# EasyEDA Pro project ProProject_校电赛c题第二版_2024-10-13.epro, board PCB2
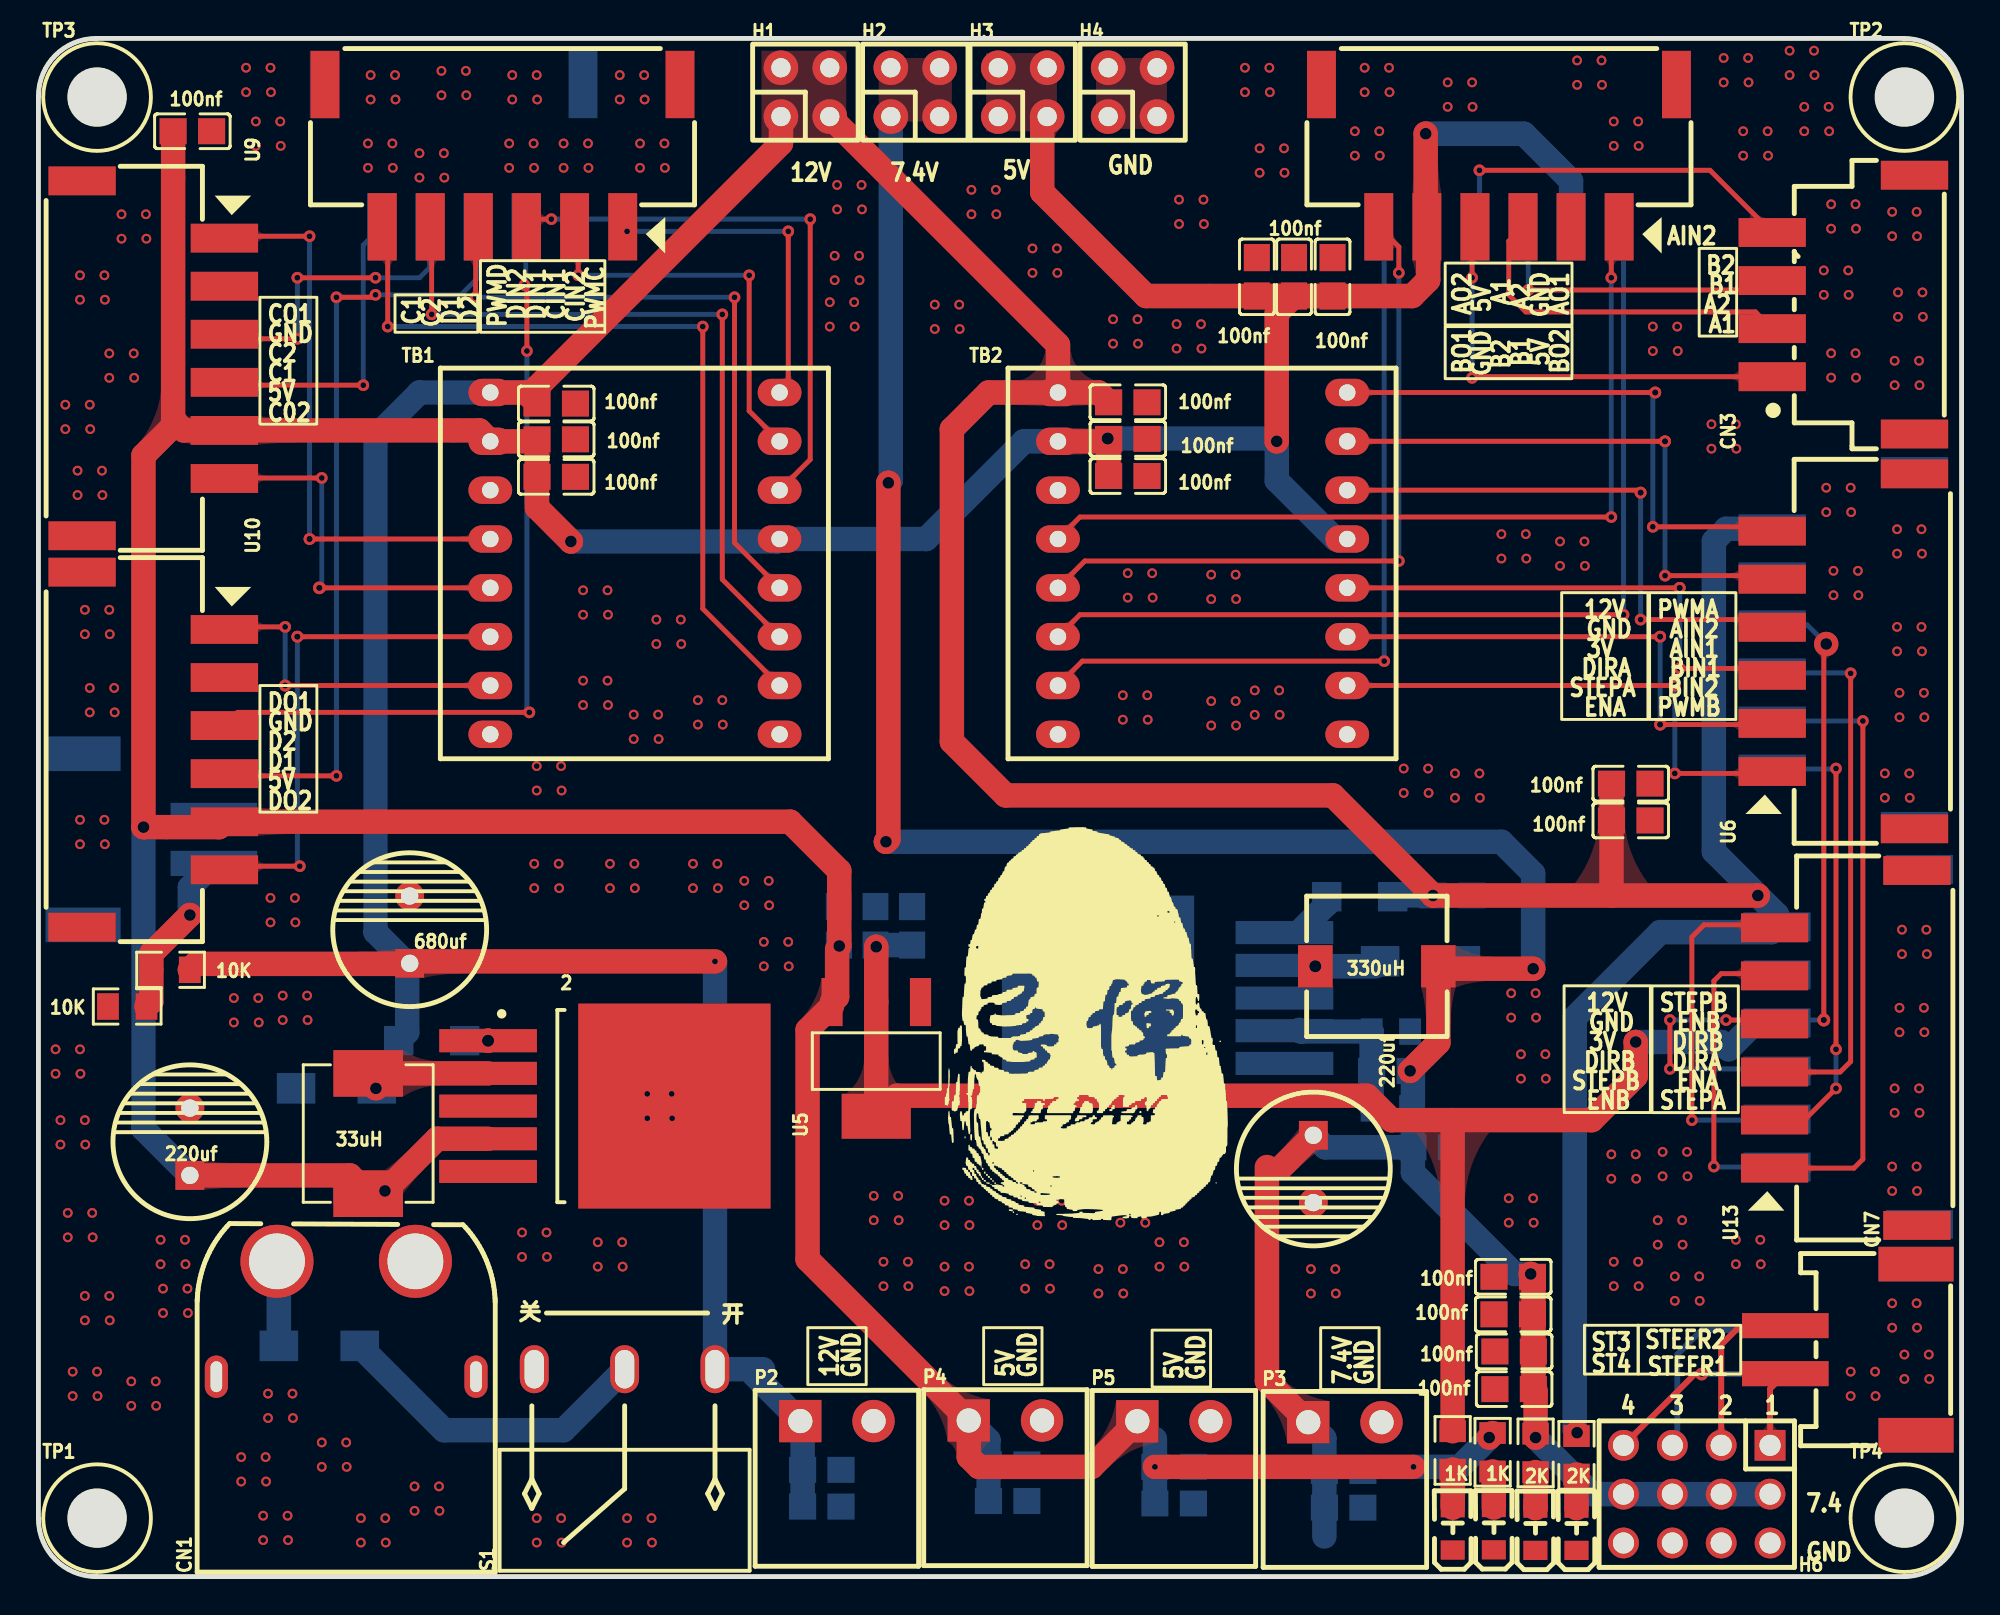
[diagram p4: board, top side]
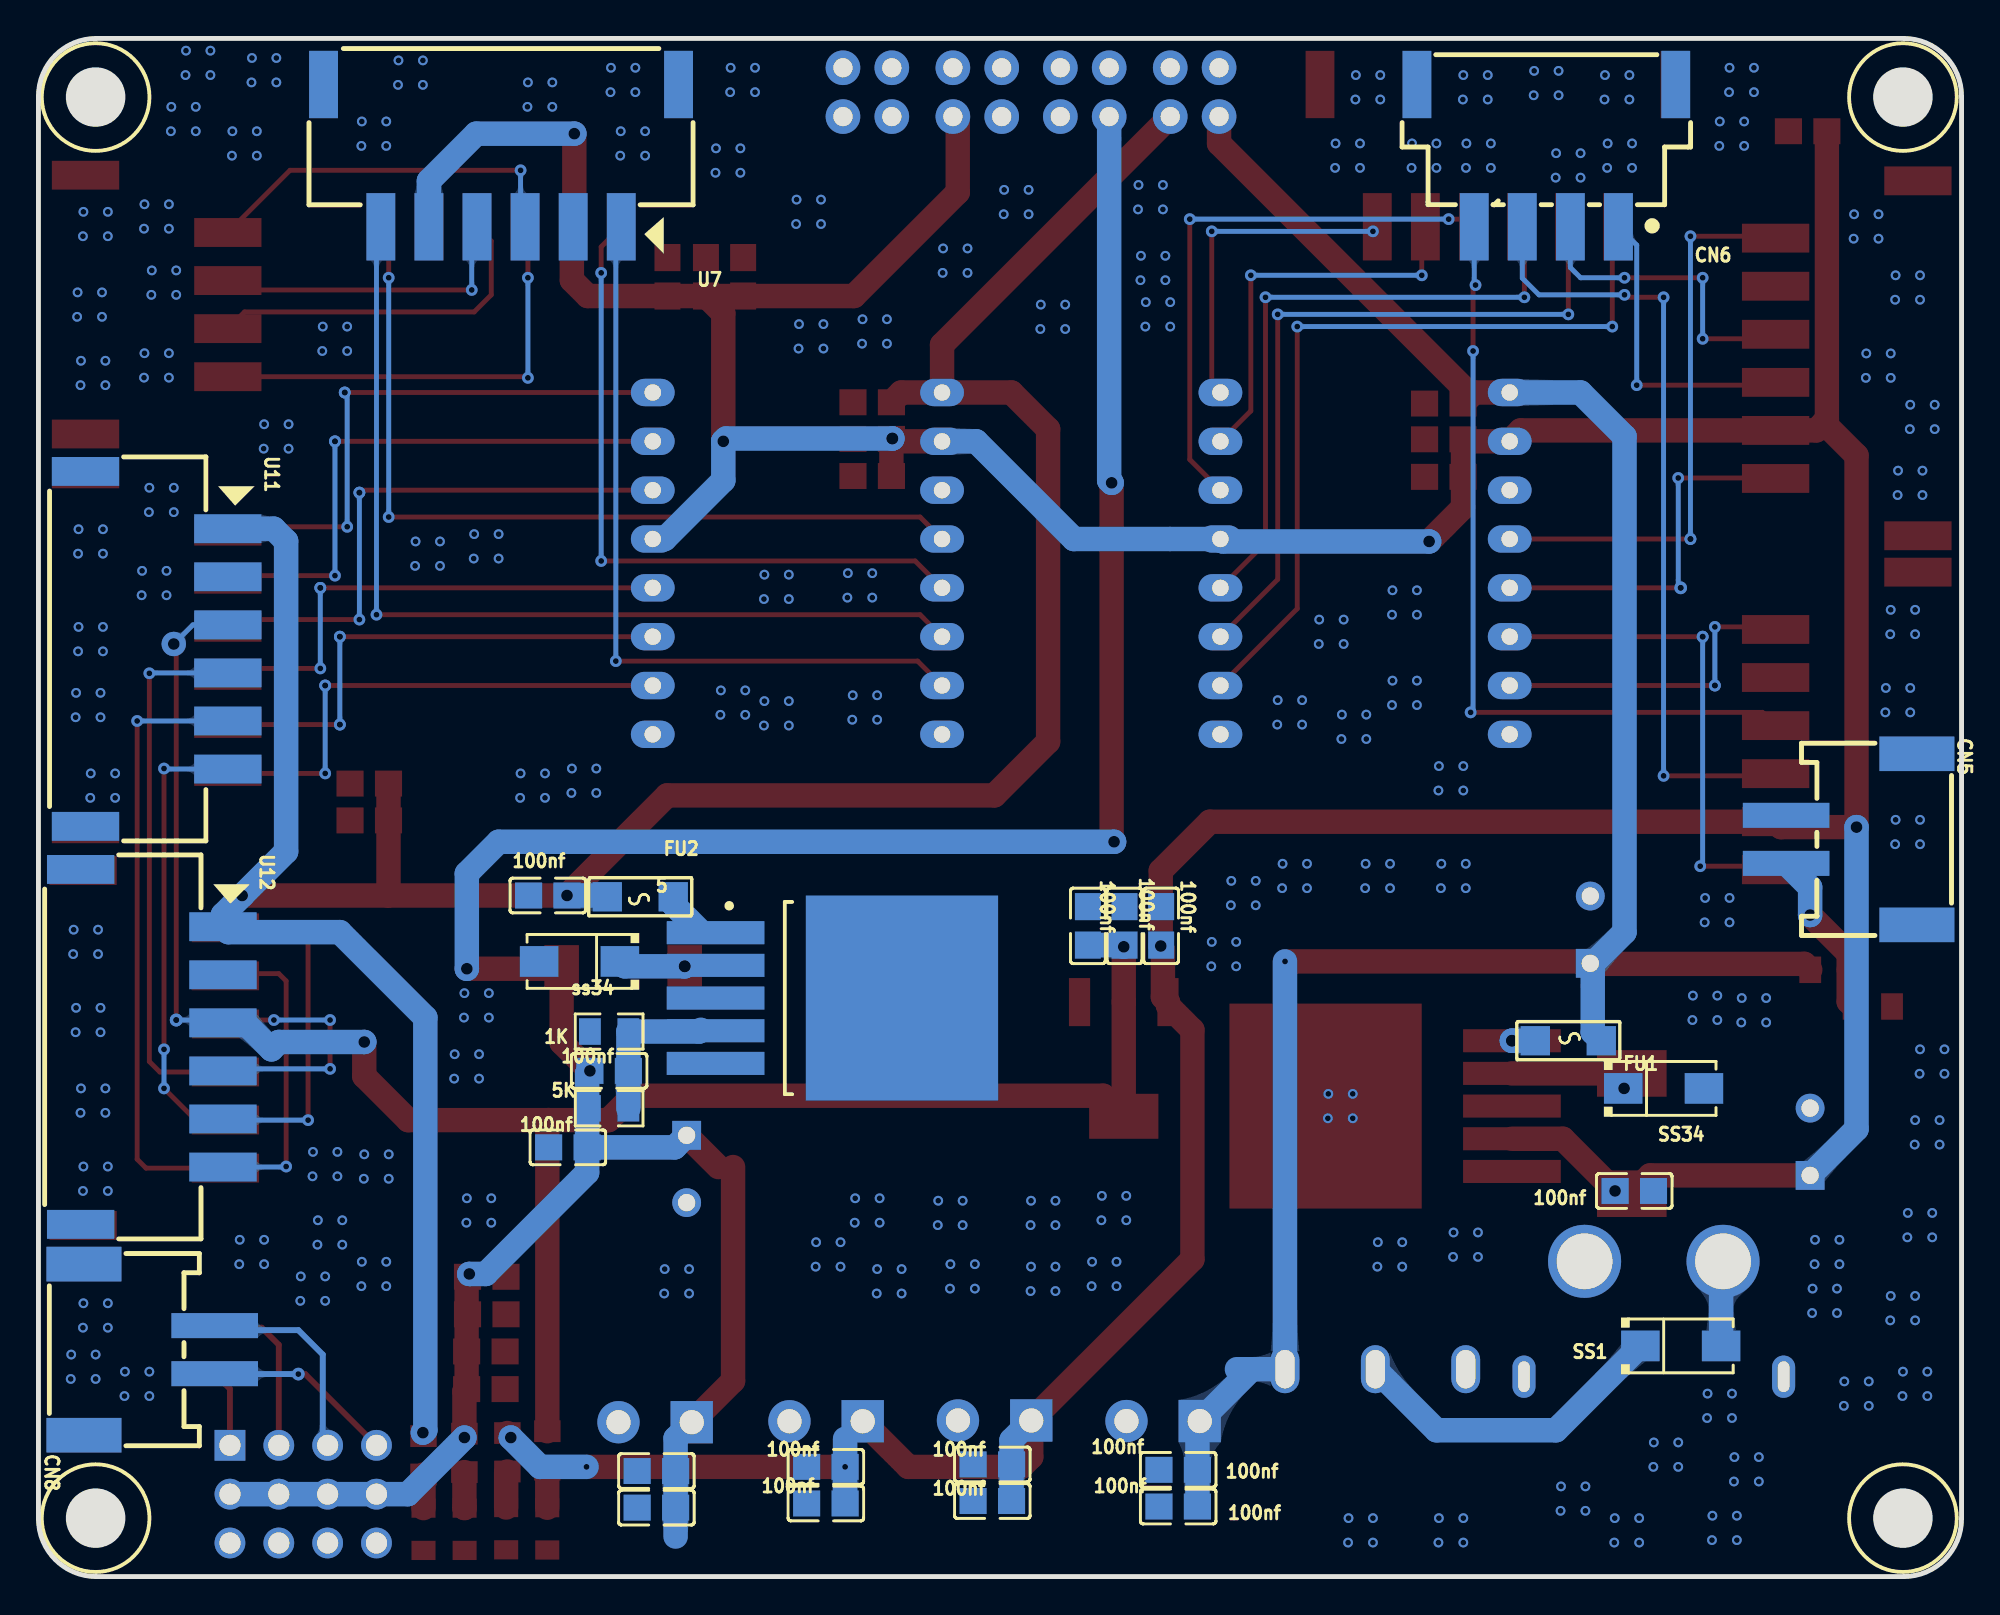
[diagram p5: board, bottom side, seen from below]

Outline 100 x 80 mm; copper layers: Top Layer, Bottom Layer. Coordinates in mm from the lower left corner of the outline.
Outline path: 0,77 0,3 arc(0.88,0.88) 3,0 97,0 arc(99.12,0.88) 100,3 100,77 arc(99.12,79.12) 97,80 3,80 arc(0.88,79.12) 0,77
Stack: Top Layer 0.035mm / Dielectric1 1.51mm FR4 er 4.5 / Bottom Layer 0.035mm

## Design rules (mm)
template: JLCPCB Capability(Two Layers Board)
spacing copperThickness1oz (default): track to track 0.102, other pairs 0.152 to 0.3
spacing copperThickness2oz: track to track 0.203, other pairs 0.152 to 0.3
track width copperThickness1oz (default): min 0.127, default 0.254, max 2.54
track width copperThickness2oz: min 0.203, default 0.254, max 2.54
differential pair differentialPair (default): width min 0.127, default 0.254, max 2.54; gap min 0.152, default 0.152
via viaSize (default): diameter min 0.5, default 0.61, max 10; hole min 0.3, default 0.305, max 6.3

## Placement (name value [footprint] x y rotation side)
1K  -  [R0805]  73.54 6.56 270 top
1K#2  -  [R0805]  75.62 6.46 270 top
1K#3  -  [R0805]  70.32 28.35 180 bottom
2  LM2596-5V  [lm2596]  26.45 25.11 0 top
2K  -  [R0805]  77.85 6.43 270 top
2K#2  -  [R0805]  79.98 6.31 270 top
5  LM2596-ADJ  [lm2596-adj]  60.45 29.96 180 bottom
5K  5K  [R0805]  70.32 24.36 0 bottom
10K  -  [R0805]  6.87 31.56 0 top
10K#2  -  [R0805]  4.61 29.65 0 top
33uH  33uH  [IND-SMD_L7.0-W6.6_FXL0630]  17.14 23.04 90 top
100nf  -  [C0805]  8 75.17 180 top
100nf#2  -  [C0805]  67.29 67.6 270 top
100nf#3  -  [C0805]  65.29 67.6 270 top
100nf#4  -  [C0805]  56.65 61.08 0 top
100nf#5  -  [C0805]  56.65 59.17 0 top
100nf#6  -  [C0805]  56.65 57.24 0 top
100nf#7  -  [C0805]  26.92 61.01 0 top
100nf#8  -  [C0805]  26.92 59.15 0 top
100nf#9  -  [C0805]  26.92 57.2 0 top
100nf#10  -  [C0805]  63.36 67.6 270 top
100nf#11  -  [C0805]  82.8 39.33 0 top
100nf#12  -  [C0805]  82.8 41.24 0 top
100nf#13  -  [C0805]  76.74 9.75 0 top
100nf#14  -  [C0805]  76.74 11.71 0 top
100nf#15  -  [C0805]  76.69 13.64 0 top
100nf#16  -  [C0805]  76.69 15.59 0 top
100nf#17  -  [C0805]  17.02 20.06 0 bottom
100nf#18  -  [C0805]  73.52 35.42 180 bottom
100nf#19  -  [C0805]  70.32 26.3 0 bottom
100nf#20  -  [C0805]  72.47 22.32 180 bottom
100nf#21  -  [C0805]  40.73 5.55 0 bottom
100nf#22  -  [C0805]  40.73 3.64 0 bottom
100nf#23  -  [C0805]  67.87 5.49 0 bottom
100nf#24  -  [C0805]  67.87 3.58 0 bottom
100nf#25  -  [C0805]  50.4 5.83 0 bottom
100nf#26  -  [C0805]  50.4 3.93 0 bottom
100nf#27  -  [C0805]  59.05 5.71 0 bottom
100nf#28  -  [C0805]  59.05 3.8 0 bottom
100nf#29  -  [C0805]  41.62 33.84 90 bottom
100nf#30  -  [C0805]  43.53 33.84 90 bottom
100nf#31  -  [C0805]  45.43 33.84 90 bottom
220uf  -  [680uf]  7.87 22.61 90 top
220uf#2  -  [680uf]  66.29 21.2 270 top
330uH  330uH  [IND-SMD_L7.3-W7.3_YPRH0704]  69.6 31.74 0 top
680uf  -  [680uf]  19.3 33.65 90 top
CN1  XT60PW-M  [CONN-TH_XT60PW-M]  16 13.4 90 top
CN3  WAFER-254W-4A  [CONN-SMD_4P-P2.50-WAFER-254W-4P]  93.85 66.16 90 top
CN5  HCZZ0021-2  [CONN-SMD_2P-P2.50-A2501-WF-02A]  5.72 38.34 270 bottom
CN6  WAFER-254W-4A  [CONN-SMD_4P-P2.50-WAFER-254W-4P]  21.59 73.9 0 bottom
CN7  HCZZ0021-2  [CONN-SMD_2P-P2.50-A2501-WF-02A]  94.23 11.8 270 top
CN8  HCZZ0021-2  [CONN-SMD_2P-P2.50-A2501-WF-02A]  94.23 11.8 90 bottom
FU1  3A  [3a熔断器]  20.45 27.68 0 bottom
FU2  3A  [3a熔断器]  68.71 35.55 180 bottom
H1  -  [HDR-TH_4P-P2.54-V-F-R2-C2-S2.54]  39.88 77.21 0 top
H2  -  [HDR-TH_4P-P2.54-V-F-R2-C2-S2.54]  45.59 77.21 0 top
H3  -  [HDR-TH_4P-P2.54-V-F-R2-C2-S2.54]  51.18 77.21 0 top
H4  -  [HDR-TH_4P-P2.54-V-F-R2-C2-S2.54]  56.9 77.21 0 top
H6  01.5.5.1.304.03  [HDR-TH_12P-P2.54-V-M-R3-C4-S2.54]  86.23 4.29 180 top
LED1  -  [LED_0805]  79.98 2.51 90 top
LED2  -  [LED_0805]  77.85 2.51 90 top
LED3  -  [LED_0805]  75.68 2.54 90 top
LED4  -  [LED_0805]  73.55 2.53 90 top
P2  WJ15EDGRC-3.81-2P  [CONN-TH_2P-P3.81_WJ15EDGRC-3.81-2P]  41.52 8.09 0 top
P3  WJ15EDGRC-3.81-2P  [CONN-TH_2P-P3.81_WJ15EDGRC-3.81-2P]  67.93 8.03 0 top
P4  WJ15EDGRC-3.81-2P  [CONN-TH_2P-P3.81_WJ15EDGRC-3.81-2P]  50.28 8.12 0 top
P5  WJ15EDGRC-3.81-2P  [CONN-TH_2P-P3.81_WJ15EDGRC-3.81-2P]  59.04 8.08 0 top
S1  单刀双掷  [弯]  30.48 3.29 90 top
SS1  SS34  [SMA_L4.3-W2.5-LS5.0-RD]  14.6 12 180 bottom
ss34  SS34  [SMA_L4.3-W2.5-LS5.0-RD]  71.87 31.99 0 bottom
SS34  SS34  [SMA_L4.3-W2.5-LS5.0-RD]  15.49 25.39 180 bottom
TB1  TB6612-MOD  [tb6612fng封装]  30.99 52.7 0 top
TB2  TB6612-MOD  [tb6612fng封装]  60.51 52.7 0 top
TP1  M3铜柱带丝印  [M3铜柱]  3.05 3.04 0 top
TP2  M3铜柱带丝印  [M3铜柱]  97.03 76.95 0 top
TP3  M3铜柱带丝印  [M3铜柱]  3.05 76.95 0 top
TP4  M3铜柱带丝印  [M3铜柱]  97.03 3.04 0 top
U4  BX-XH2.54-6PWT  [CONN-SMD_6P-P2.50_BX-XH2.54-6PWT]  75.95 73.9 180 top
U5  AMS1117-3.3  [SOT-223-3_L6.5-W3.4-P2.30-LS7.0-BR]  43.57 26.91 90 top
U6  BX-XH2.54-6PWT  [CONN-SMD_6P-P2.50_BX-XH2.54-6PWT]  93.85 48.12 90 top
U7  BX-XH2.54-6PWT  [CONN-SMD_6P-P2.50_BX-XH2.54-6PWT]  75.95 73.9 0 bottom
U8  BX-XH2.54-6PWT  [CONN-SMD_6P-P2.50_BX-XH2.54-6PWT]  24.13 73.9 180 top
U9  BX-XH2.54-6PWT  [CONN-SMD_6P-P2.50_BX-XH2.54-6PWT]  5.97 63.36 270 top
U10  BX-XH2.54-6PWT  [CONN-SMD_6P-P2.50_BX-XH2.54-6PWT]  5.97 43.01 270 top
U11  BX-XH2.54-6PWT  [CONN-SMD_6P-P2.50_BX-XH2.54-6PWT]  93.85 48.25 270 bottom
U12  BX-XH2.54-6PWT  [CONN-SMD_6P-P2.50_BX-XH2.54-6PWT]  94.11 27.55 270 bottom
U13  BX-XH2.54-6PWT  [CONN-SMD_6P-P2.50_BX-XH2.54-6PWT]  93.98 27.49 90 top

## Footprints (pads in the part's own frame, mm; a bottom-side part is the same pattern mirrored in y, then rotated)
3a熔断器
  rect 1.524x1.524 smd: 1(-1.714,-0.194) 2(1.714,-0.194)
680uf
  rect 1.5x1.5 hole 0.9: 1(-1.75,0)
  round 1.5 hole 0.9: 2(1.75,0)
C0805
  rect 1.41x1.35 smd: 1(-1,0) 2(1,0)
CONN-SMD_2P-P2.50-A2501-WF-02A
  rect 1.3x4.5 smd: 1(-1.25,-3.4) 2(1.25,-3.4)
  rect 1.8x3.9 smd: 3(-4.45,3.4) 4(4.45,3.4)
CONN-SMD_4P-P2.50-WAFER-254W-4P
  rect 1.5x3.5 smd: 1(-3.75,3.7) 2(-1.25,3.7) 3(1.25,3.7) 4(3.75,3.7) 5(-6.73,-3.7) 6(6.73,-3.7)
CONN-SMD_6P-P2.50_BX-XH2.54-6PWT
  rect 1.5x3.5 smd: 1(-6.25,3.7) 2(-3.75,3.7) 3(-1.25,3.7) 4(1.25,3.7) 5(3.75,3.7) 6(6.25,3.7) 7(9.23,-3.7) 8(-9.23,-3.7)
CONN-TH_2P-P3.81_WJ15EDGRC-3.81-2P
  rect 2.2x2.2 hole 1.26: 1(-1.905,0)
  round 2.2 hole 1.26: 2(1.905,0)
CONN-TH_XT60PW-M
  round 3.8 hole 2.9: 1(3,-3.6) 2(3,3.6)
  oval 2.2x1.2 hole 1.6x0.6: 3(-3,6.75) 4(-3,-6.75)
HDR-TH_4P-P2.54-V-F-R2-C2-S2.54
  round 1.8 hole 1: 1(-1.27,-1.27) 2(-1.27,1.27) 3(1.27,-1.27) 4(1.27,1.27)
HDR-TH_12P-P2.54-V-M-R3-C4-S2.54
  rect 1.6x1.6 hole 1.1: 1(-3.81,-2.54)
  round 1.6 hole 1.1: 2(-3.81,0) 3(-3.81,2.54) 4(-1.27,-2.54) 5(-1.27,0) 6(-1.27,2.54) 7(1.27,-2.54) 8(1.27,0) 9(1.27,2.54) 10(3.81,-2.54) 11(3.81,0) 12(3.81,2.54)
IND-SMD_L7.0-W6.6_FXL0630
  rect 2.424x3.62 smd: 1(3.128,0) 2(-3.128,0)
IND-SMD_L7.3-W7.3_YPRH0704
  rect 1.8x2.2 smd: 1(-3.2,0) 2(3.2,0)
LED_0805
  rect 1x1.25 smd: 1(-1.15,0.005) 2(1.05,0.005)
lm2596
  rect 5.08x1.2 smd: 1(-3.067,2.765) 2(-3.067,1.065) 3(-3.067,-0.635) 4(-3.067,-2.335) 5(-3.067,-4.035)
  rect 10x10.66 smd: 3(6.623,-0.635)
lm2596-adj
  rect 5.08x1.2 smd: 1(-4.337,3.527) 2(-4.337,1.827) 3(-4.337,0.127) 4(-4.337,-1.573) 5(-4.337,-3.273)
  rect 10x10.66 smd: 3(5.353,0.127)
R0805
  rect 1.133x1.377 smd: 1(-1,0) 2(1,0)
SMA_L4.3-W2.5-LS5.0-RD
  rect 2x1.593 smd: 1(-2.1,0) 2(2.1,0)
SOT-223-3_L6.5-W3.4-P2.30-LS7.0-BR
  rect 2.5x1.1 smd: 1(2.97,-2.3) 2(2.97,0) 3(2.97,2.3)
  rect 2.34x3.6 smd: 4(-2.97,0)
tb6612fng封装
  oval 2.276x1.423 hole 0.855x0.85: 1(-7.493,8.89) 2(-7.493,6.35) 3(-7.493,3.81) 4(-7.493,1.27) 5(-7.493,-1.27) 6(-7.493,-3.81) 7(-7.493,-6.35) 8(-7.493,-8.89) 9(7.55,-8.89) 10(7.55,-6.35) 11(7.55,-3.81) 12(7.55,-1.27) 13(7.55,1.27) 14(7.55,3.81) 15(7.55,6.35) 16(7.55,8.89)
弯
  rrect 2.5x1.5 hole 2x1: 1(7.493,4.699) 2(7.493,0) 3(7.493,-4.699)

## Nets
GND: 1K#3.1 2.3 2.5 5.3 5.5 10K#2.1 100nf.1 100nf#2.1 100nf#3.1 100nf#4.2 100nf#5.2 100nf#6.2 100nf#7.2 100nf#8.2 100nf#9.2 100nf#10.1 100nf#11.2 100nf#12.2 100nf#13.1 100nf#14.1 100nf#15.1 100nf#16.1 100nf#17.1 100nf#18.1 100nf#20.1 100nf#21.2 100nf#22.2 100nf#23.2 100nf#24.2 100nf#25.2 100nf#26.2 100nf#27.2 100nf#28.2 100nf#29.2 100nf#30.2 100nf#31.2 220uf.2 220uf#2.2 680uf.2 CN1.1 CN1.3 CN1.4 CN5.1 H4.1 H4.2 H4.3 H4.4 H6.3 H6.6 H6.9 H6.12 LED1.1 LED2.1 LED3.1 LED4.1 P2.2 P3.2 P4.2 P5.2 ss34.2 SS34.2 TB1.3 TB1.8 TB1.9 TB2.3 TB2.8 TB2.9 U4.2 U5.1 U7.2 U9.2 U10.2 U11.2 U12.2
VCC3V: 1K.1 100nf#30.1 100nf#31.1 U5.2 U5.4 U11.3 U12.3
VCC5V: 1K#2.1 2.4 33uH.2 100nf.2 100nf#2.2 100nf#3.2 100nf#5.1 100nf#6.1 100nf#8.1 100nf#9.1 100nf#10.2 100nf#17.2 100nf#25.1 100nf#26.1 100nf#27.1 100nf#28.1 100nf#29.1 220uf.1 H3.1 H3.2 H3.3 H3.4 P4.1 P5.1 TB1.2 TB1.13 TB2.2 TB2.13 U4.5 U5.3 U7.5 U9.5 U10.5
VCC7.4V: 2K.1 5K.2 100nf#13.2 100nf#14.2 100nf#15.2 100nf#16.2 100nf#19.2 100nf#20.2 100nf#23.1 100nf#24.1 220uf#2.1 330uH.2 H2.1 H2.2 H2.3 H2.4 H6.2 H6.5 H6.8 H6.11 P3.1
VCC12V: 2K#2.1 10K.2 100nf#4.1 100nf#7.1 100nf#11.1 100nf#12.1 100nf#18.2 100nf#21.1 100nf#22.1 680uf.1 FU1.1 FU2.1 H1.1 H1.2 H1.3 H1.4 P2.1 S1.3 TB1.1 TB2.1 U11.1 U12.1
AIN1: TB2.14 U6.4
AIN2: TB2.15 U6.5
AO1: TB2.4 U4.1
AO2: TB2.5 U4.6
BIN1: TB2.12 U6.3
BIN2: TB2.11 U6.2
BO1: TB2.7 U7.1
BO2: TB2.6 U7.6
CIN1: TB1.14 U8.3
CIN2: TB1.15 U8.2
CO1: TB1.4 U9.1
CO2: TB1.5 U9.6
DIN1: TB1.12 U8.4
DIN2: TB1.11 U8.5
DIRA: U11.4 U13.3
DIRB: U12.4 U13.4
DO1: TB1.7 U10.1
DO2: TB1.6 U10.6
ENA: U11.6 U13.2
ENB: U12.6 U13.5
ENCOA1: CN3.1 U4.4
ENCOA2: CN3.2 U4.3
ENCOB1: CN3.3 U7.4
ENCOB2: CN3.4 U7.3
ENCOC1: CN6.1 U9.4
ENCOC2: CN6.2 U9.3
ENCOD1: CN6.3 U10.4
ENCOD2: CN6.4 U10.3
POWER12V: S1.2 SS1.1
PWMA: TB2.16 U6.6
PWMB: TB2.10 U6.1
PWMC: TB1.16 U8.1
PWMD: TB1.10 U8.6
STEER1: CN7.2 H6.1
STEER2: CN7.1 H6.4
STEER3: CN8.2 H6.7
STEER4: CN8.1 H6.10
STEPA: U11.5 U13.1
STEPB: U12.5 U13.6
$1N3758: 2.1 FU1.2
$1N3767: 2.2 33uH.1 SS34.1
$1N3769: 5.1 FU2.2
$1N3771: 1K#3.2 5.4 5K.1 100nf#19.1
$1N3772: 5.2 330uH.1 ss34.1
$1N3795: 10K.1 10K#2.2 CN5.2
$1N3802: 1K.2 LED4.2
$1N3803: 1K#2.2 LED3.2
$1N3804: 2K.2 LED2.2
$1N3805: 2K#2.2 LED1.2
$1N4033: CN1.2 SS1.2

Pads without a net: CN3 5 6; CN5 3 4; CN6 5 6; CN7 3 4; CN8 3 4; S1 1; U4 7 8; U6 7 8; U7 7 8; U8 7 8; U9 7 8; U10 7 8; U11 7 8; U12 7 8; U13 7 8

## Via types
v1: diameter 0.508, hole 0.3, Top Layer to Bottom Layer, 484 vias
v2: diameter 1.27, hole 0.61, Top Layer to Bottom Layer, 33 vias
v3: diameter 0.66, hole 0.305, Top Layer to Bottom Layer, 11 vias
v4: diameter 0.61, hole 0.305, Top Layer to Bottom Layer, 73 vias

## Routing (per net, layer and track width the routed paths; a pad name or vN(x,y) marks a point on that pad's centre or on a via; arc(x,y) is an arc through that point)
GND:
  vias: v1(0.89,27.42) v1(0.89,26.15) v1(1.14,23.74) v1(1.14,22.47) v1(1.4,60.95) v1(1.4,59.68) v1(1.52,18.91) v1(1.52,17.64) v1(1.78,10.66) v1(1.78,9.39) v1(2.03,57.52) v1(2.03,56.25) v1(2.16,67.68) v1(2.16,66.41) v1(2.16,39.36) v1(2.16,38.09) v1(2.16,27.42) v1(2.18,26.15) v1(2.41,50.28) v1(2.41,49.01) v1(2.41,23.74) v1(2.44,22.47) v1(2.41,14.59) v1(2.41,13.33) v1(2.67,60.95) v1(2.69,59.68) v1(2.67,46.22) v1(2.67,44.95) v1(2.79,18.91) v1(2.82,17.64) v1(3.05,10.66) v1(3.07,9.39) v1(3.3,57.52) v1(3.33,56.25) v1(3.43,67.68) v1(3.45,66.41) v1(3.43,39.36) v1(3.45,38.09) v1(3.68,63.62) v1(3.68,62.35) v1(3.68,50.28) v1(3.68,14.59) v1(3.71,49.01) v1(3.71,13.33) v1(3.94,46.22) v1(3.96,44.95) v1(4.32,70.86) v1(4.32,69.59) v1(4.83,10.15) v1(4.83,8.88) v1(4.95,63.62) v1(4.98,62.35) v1(5.59,70.86) v1(5.61,69.59) v1(6.1,10.15) v1(6.12,8.88) v1(6.35,17.52) v1(6.35,16.25) v1(6.48,14.98) v1(6.48,13.71) v1(7.62,17.52) v1(7.64,16.25) v1(7.75,14.98) v1(7.77,13.71) v1(10.16,30.09) v1(10.16,28.82) v1(10.54,6.21) v1(10.54,4.94) v1(10.8,78.48) v1(10.8,77.21) v1(11.3,75.68) v1(11.3,74.41) v1(11.43,30.09) v1(11.45,28.82) v1(11.68,3.17) v1(11.68,1.9) v1(11.81,6.21) v1(11.83,4.94) v1(11.94,9.52) v1(11.94,8.25) v1(12.06,78.48) v1(12.09,77.21) v1(12.06,35.3) v1(12.06,34.03) v1(12.57,75.68) v1(12.6,74.41) v1(12.7,30.22) v1(12.7,28.95) v1(12.95,3.17) v1(12.98,1.9) v1(13.21,9.52) v1(13.23,8.25) v1(13.33,35.3) v1(13.36,34.03) v1(13.97,30.22) v1(13.99,28.95) v1(14.73,6.98) v1(14.73,5.71) v1(16,6.98) v1(16.03,5.71) v1(16.76,3.04) v1(16.76,1.77) v1(17.13,74.54) v1(17.13,73.27) v1(17.27,78.1) v1(17.27,76.83) v1(18.03,3.04) v1(18.06,1.77) v1(18.4,74.54) v1(18.43,73.27) v1(18.54,78.1) v1(18.57,76.83) v1(19.56,4.69) v1(19.56,3.42) v1(19.81,74.03) v1(19.81,72.76) v1(20.83,4.69) v1(20.85,3.42) v1(20.95,78.31) v1(20.95,77.04) v1(21.08,74.03) v1(21.11,72.76) v1(22.22,78.31) v1(22.25,77.04) v1(24.48,74.54) v1(24.48,73.27) v1(24.64,78.1) v1(24.64,76.83) v1(25.15,17.9) v1(25.15,16.63) v1(25.75,74.54) v1(25.77,73.27) v1(25.78,37.07) v1(25.78,35.8) v1(25.91,78.1) v1(25.93,76.83) v1(25.91,42.15) v1(25.91,40.88) v1(25.91,3.04) v1(25.91,1.77) v1(26.42,17.9) v1(26.44,16.63) v1(27.05,37.07) v1(27.08,35.8) v1(27.18,42.15) v1(27.18,3.04) v1(27.2,40.88) v1(27.2,1.77) v1(27.31,74.54) v1(27.31,73.27) v1(28.32,51.3) v1(28.32,50.03) v1(28.32,46.6) v1(28.32,45.33) v1(28.58,74.54) v1(28.6,73.27) v1(29.08,17.39) v1(29.08,16.12) v1(29.59,51.3) v1(29.59,46.6) v1(29.61,50.03) v1(29.61,45.33) v1(29.72,37.07) v1(29.72,35.8) v1(30.23,78.1) v1(30.23,76.83) v1(30.35,17.39) v1(30.38,16.12) v1(30.61,3.04) v1(30.61,1.77) v1(30.95,44.83) v1(30.95,43.56) v1(30.99,37.07) v1(31.01,35.8) v1(31.28,74.54) v1(31.28,73.27) v1(31.5,78.1) v1(31.52,76.83) v1(31.66,25.11) v1(31.66,23.84) v1(31.88,3.04) v1(31.9,1.77) v1(32.13,49.77) v1(32.13,48.5) v1(32.22,44.83) v1(32.25,43.56) v1(32.55,74.54) v1(32.58,73.27) v1(32.93,25.11) v1(32.95,23.84) v1(33.4,49.77) v1(33.42,48.5) v1(34.04,37.07) v1(34.04,35.8) v1(34.29,45.58) v1(34.29,44.31) v1(35.31,37.07) v1(35.33,35.8) v1(35.56,45.58) v1(35.58,44.31) v1(36.7,36.19) v1(36.7,34.92) v1(37.72,33.01) v1(37.72,31.74) v1(37.97,36.19) v1(38,34.92) v1(38.99,33.01) v1(39.01,31.74) v1(41.15,66.28) v1(41.15,65.01) v1(41.4,68.7) v1(41.4,67.43) v1(41.53,72.38) v1(41.53,71.11) v1(42.42,66.28) v1(42.44,65.01) v1(42.67,68.7) v1(42.7,67.43) v1(42.8,72.38) v1(42.82,71.11) v1(43.43,19.8) v1(43.43,18.53) v1(43.94,16.37) v1(43.94,15.1) v1(44.7,19.8) v1(44.73,18.53) v1(45.21,16.37) v1(45.24,15.1) v1(46.61,66.16) v1(46.61,64.89) v1(47.12,19.55) v1(47.12,18.28) v1(47.12,16.12) v1(47.12,14.85) v1(47.88,66.16) v1(47.9,64.89) v1(48.39,19.55) v1(48.39,16.12) v1(48.41,18.28) v1(48.41,14.85) v1(48.51,72.13) v1(48.51,70.86) v1(49.78,72.13) v1(49.81,70.86) v1(51.31,16.25) v1(51.31,14.98) v1(51.69,69.08) v1(51.69,67.81) v1(51.94,19.55) v1(51.94,18.28) v1(52.58,16.25) v1(52.6,14.98) v1(52.96,69.08) v1(52.98,67.81) v1(53.21,19.55) v1(53.24,18.28) v1(55.12,15.99) v1(55.12,14.72) v1(55.88,65.4) v1(55.88,64.13) v1(56.26,19.68) v1(56.26,18.41) v1(56.39,45.84) v1(56.39,44.57) v1(56.39,15.99) v1(56.41,14.72) v1(56.64,52.19) v1(56.64,50.92) v1(57.15,65.4) v1(57.17,64.13) v1(57.53,19.68) v1(57.55,18.41) v1(57.66,45.84) v1(57.68,44.57) v1(57.91,52.19) v1(57.94,50.92) v1(58.29,17.39) v1(58.29,16.12) v1(59.18,65.14) v1(59.18,63.87) v1(59.31,71.62) v1(59.31,70.35) v1(59.56,17.39) v1(59.59,16.12) v1(60.45,65.14) v1(60.48,63.87) v1(60.58,71.62) v1(60.6,70.35) v1(60.98,52.11) v1(60.98,50.84) v1(60.98,45.53) v1(60.98,44.26) v1(62.25,52.11) v1(62.28,50.84) v1(62.25,45.53) v1(62.28,44.26) v1(62.74,78.48) v1(62.74,77.21) v1(63.25,46.09) v1(63.25,44.82) v1(63.5,74.29) v1(63.5,73.02) v1(64.01,78.48) v1(64.03,77.21) v1(64.52,46.09) v1(64.54,44.82) v1(64.77,74.29) v1(64.79,73.02) v1(66.17,15.99) v1(66.17,14.72) v1(67.44,15.99) v1(67.46,14.72) v1(68.45,75.17) v1(68.45,73.9) v1(68.96,78.48) v1(68.96,77.21) v1(69.72,75.17) v1(69.75,73.9) v1(70.23,78.48) v1(70.26,77.21) v1(70.99,42.03) v1(70.99,40.76) v1(72.26,42.03) v1(72.29,40.76) v1(73.28,77.71) v1(73.28,76.44) v1(73.66,41.77) v1(73.66,40.5) v1(74.55,77.71) v1(74.57,76.44) v1(74.93,41.77) v1(74.95,40.5) v1(76.07,54.22) v1(76.07,52.95) v1(76.45,19.68) v1(76.45,18.41) v1(76.58,30.34) v1(76.58,29.07) v1(77.09,27.17) v1(77.09,25.9) v1(77.34,54.22) v1(77.37,52.95) v1(77.72,19.68) v1(77.75,18.41) v1(77.85,30.34) v1(77.87,29.07) v1(78.36,27.17) v1(78.38,25.9) v1(79.12,53.84) v1(79.12,52.57) v1(80.01,78.86) v1(80.01,77.59) v1(80.39,53.84) v1(80.42,52.57) v1(81.28,78.86) v1(81.3,77.59) v1(81.79,21.96) v1(81.79,20.69) v1(81.92,75.68) v1(81.92,74.41) v1(81.92,16.37) v1(81.92,15.1) v1(83.06,21.96) v1(83.08,20.69) v1(83.18,75.68) v1(83.18,16.37) v1(83.21,74.41) v1(83.21,15.1) v1(83.95,65.01) v1(83.95,63.74) v1(84.2,18.53) v1(84.2,17.26) v1(84.45,22.09) v1(84.45,20.82) v1(85.09,15.61) v1(85.09,14.34) v1(85.22,65.01) v1(85.24,63.74) v1(85.47,18.53) v1(85.49,17.26) v1(85.73,22.09) v1(85.75,20.82) v1(86.36,15.61) v1(86.38,14.34) v1(86.99,59.93) v1(86.99,58.66) v1(87.63,78.98) v1(87.63,77.71) v1(88.27,59.93) v1(88.29,58.66) v1(88.27,17.52) v1(88.27,16.25) v1(88.65,75.17) v1(88.65,73.9) v1(88.9,78.98) v1(88.92,77.71) v1(89.54,17.52) v1(89.56,16.25) v1(89.92,75.17) v1(89.94,73.9) v1(91.06,79.37) v1(91.06,78.1) v1(91.82,76.44) v1(91.82,75.17) v1(92.33,79.37) v1(92.35,78.1) v1(92.84,67.94) v1(92.84,66.67) v1(92.96,56.63) v1(92.96,55.36) v1(93.09,76.44) v1(93.11,75.17) v1(93.22,71.38) v1(93.22,70.11) v1(93.22,63.63) v1(93.22,62.36) v1(93.34,52.31) v1(93.34,51.04) v1(94.11,67.94) v1(94.13,66.67) v1(94.23,56.63) v1(94.26,55.36) v1(94.23,10.66) v1(94.23,9.39) v1(94.49,71.38) v1(94.49,63.63) v1(94.51,70.11) v1(94.51,62.36) v1(94.61,52.31) v1(94.64,51.04) v1(95.5,10.66) v1(95.53,9.39) v1(96.01,41.77) v1(96.01,40.5) v1(96.39,70.98) v1(96.39,69.71) v1(96.39,21.33) v1(96.39,20.06) v1(96.39,14.21) v1(96.39,12.94) v1(96.52,63.24) v1(96.52,61.97) v1(96.52,25.39) v1(96.52,24.12) v1(96.7,66.79) v1(96.7,65.52) v1(96.65,54.47) v1(96.65,53.2) v1(96.65,49.39) v1(96.65,48.12) v1(96.77,45.96) v1(96.77,44.69) v1(96.77,29.58) v1(96.77,28.31) v1(96.9,33.65) v1(96.9,32.38) v1(97.03,11.55) v1(97.03,10.28) v1(97.28,41.77) v1(97.31,40.5) v1(97.66,70.98) v1(97.69,69.71) v1(97.66,21.33) v1(97.69,20.06) v1(97.66,14.21) v1(97.69,12.94) v1(97.79,63.24) v1(97.79,25.39) v1(97.81,61.97) v1(97.81,24.12) v1(97.97,66.79) v1(97.99,65.52) v1(97.92,54.47) v1(97.94,53.2) v1(97.92,49.39) v1(97.94,48.12) v1(98.04,45.96) v1(98.07,44.69) v1(98.04,29.58) v1(98.07,28.31) v1(98.17,33.65) v1(98.2,32.38) v1(98.3,11.55) v1(98.32,10.28)
VCC3V: length 103.6
  Top Layer w0.254: v3(92.84,28.95) 92.84,48.38 v2(92.96,48.5)
  Top Layer w1.27: v2(83.06,27.8) 83.06,26.03 80.77,23.74 73.48,23.74 ; 1K.1 73.54,23.68 73.48,23.74 ; 73.48,23.74 70.36,23.74 69.09,25.01 44.63,25.01 U5.4 U5.2 v2(43.57,32.76)
  Bottom Layer w0.254: v2(92.96,48.5) 91.97,49.5 U11.3 ; v3(92.84,28.95) 90.55,28.95 U12.3
  Bottom Layer w1.27: v2(43.57,32.76) 43.57,32.81 100nf#30.1 100nf#31.1 ; v2(83.06,27.8) 87.5,27.8 87.88,27.42 89.26,28.8 U12.3
VCC5V: length 307.7
  Top Layer w1.27: 52.45,75.94 52.2,75.68 52.2,72 57.59,66.6 100nf#10.2 100nf#3.2 ; 2.4 20.73,22.77 v2(18.02,20.06) 17.88,19.91 33uH.2 16.19,20.86 220uf.1 ; v2(55.6,59.19) 55.63,59.19 100nf#5.1 ; 100nf#5.1 55.52,59.05 TB2.2 ; 100nf#5.1 100nf#6.1 ; 7.16,60.01 7,60.17 100nf.2 ; 7.16,60.01 5.46,58.31 v2(5.46,38.98) 9.39,38.98 U10.5 39.09,39.26 41.64,36.71 v2(41.64,32.8) ; 7.16,60.01 7.56,59.61 U9.5 22.93,59.61 23.5,59.05 25.82,59.05 100nf#8.1 100nf#9.1 25.92,55.6 v2(27.69,53.84) ; v2(64.39,59.05) 64.39,65.7 100nf#3.2 ; 100nf#3.2 100nf#2.2 71.44,66.6 72.26,67.43 72.26,70.14 U4.5 72.14,70.26 v2(72.14,75.05) ; 41.53,32.63 41.53,30.14 U5.3 41.27,29.7 39.99,28.43 39.99,16.5 P4.1 48.38,6.22 48.89,5.71 54.77,5.71 v2(57.14,8.08) ; v3(58.05,5.71) v3(71.5,5.71) ; v2(75.44,7.23) 75.62,7.41 1K#2.1
  Bottom Layer w1.27: v2(75.44,7.23) 73.91,5.71 v3(71.5,5.71) ; 100nf#26.1 100nf#25.1 49.4,7.09 P4.1 ; v2(5.46,38.98) 5.46,23.28 220uf.1 ; v2(68.06,53.97) 67.44,53.97 64.39,57.01 v2(64.39,59.05) 64.24,59.19 v2(55.6,59.19) ; 58.05,7.16 v3(58.05,5.71) 100nf#28.1 ; v2(27.69,53.84) 38.41,53.84 TB1.13 46.16,53.97 51.24,59.05 TB2.2 ; U7.5 79.7,72.59 77.24,75.05 v2(72.14,75.05)
VCC7.4V: length 152.1
  Top Layer w1.27: v2(77.6,15.74) 77.69,15.65 100nf#16.2 ; v2(44.2,56.89) 44.2,38.34 v2(44.07,38.22) ; 100nf#16.2 77.62,15.59 ; 100nf#16.2 77.74,15.54 100nf#14.2 100nf#13.2 77.85,9.63 2K.1 v2(77.85,7.23) ; P3.1 63.88,10.18 63.88,21.3 ; v2(71.32,26.3) 72.8,27.77 330uH.2 72.92,31.61 v2(77.72,31.61) ; 220uf#2.1 64.64,21.3
  Bottom Layer w1.27: 220uf#2.1 66.92,22.32 100nf#20.2 ; v2(77.85,7.23) 80.79,4.29 H6.11 H6.5 v2(90.04,4.29) ; P3.1 66.87,7.19 100nf#23.1 100nf#24.1 66.87,2.08 ; v2(44.07,38.22) 76.07,38.22 77.72,36.57 v2(77.72,31.61) ; v2(44.32,75.94) 44.32,57.01 v2(44.2,56.89) ; 100nf#20.2 71.47,21.01 76.75,15.74 v2(77.6,15.74) ; 100nf#20.2 71.47,26.16 v2(71.32,26.3)
VCC12V: length 278.2
  Top Layer w1.27: 10K.2 8.18,31.87 v2(19.18,31.87) ; 100nf#12.1 100nf#11.1 81.8,35.45 81.82,35.42 ; 81.82,35.42 v2(72.52,35.42) 67.31,40.63 50.29,40.63 47.5,43.42 47.5,59.68 49.4,61.59 TB2.1 ; 81.82,35.42 v2(89.41,35.42) ; v3(35.18,31.99) 19.4,31.99 680uf.1 ; 23.5,61.59 25.35,61.59 100nf#7.1 25.92,61.86 38.61,74.54 38.61,75.94 ; TB2.1 55.14,61.59 100nf#4.1 ; TB2.1 53.01,64.07 41.15,75.94
  Bottom Layer w1.27: 37.68,10.79 36.92,10.79 ; 36.92,10.79 v2(35.18,10.79) 35.18,31.99 ; 36.92,10.79 P2.1 39.73,7.97 100nf#21.1 100nf#22.1 ; v2(19.18,31.87) 19.28,31.87 680uf.1 ; v2(19.18,31.87) 17.53,33.52 17.53,59.3 19.81,61.59 23.5,61.59 ; v2(19.18,31.87) 19.18,28.31 FU1.1 ; v2(72.52,35.42) 70.49,35.42 FU2.1 ; U11.1 87.77,54.5 87.12,53.85 87.12,37.71 v2(89.41,35.42) 90.41,34.42 U12.1 90.13,33.52 84.33,33.52 79.88,29.07 79.88,7.61 v2(80.01,7.48)
AIN1: length 28.7
  Top Layer w0.254: U6.4 89.75,49.77 v4(83.31,49.77) ; TB2.14 83.18,56.51
  Bottom Layer w0.254: v4(83.31,56.38) v4(83.31,49.77)
AIN2: length 29.2
  Top Layer w0.254: TB2.15 v4(84.58,59.05) ; U6.5 89.97,52.06 v4(84.58,52.06)
  Bottom Layer w0.254: v4(84.58,59.05) v4(84.58,52.06)
AO1: length 44.5
  Top Layer w0.254: v4(81.79,55.11) 54.16,55.11 TB2.4 ; v4(81.79,67.55) 81.79,69.8 U4.1
  Bottom Layer w0.254: v4(81.79,55.11) v4(81.79,67.55)
AO2: length 36.1
  Top Layer w0.254: v4(70.74,67.81) 70.74,69.16 U4.6 ; v4(53.01,51.43) 54.41,52.82 v4(70.74,52.82)
  Bottom Layer w0.254: v4(70.74,52.82) v4(70.74,67.81)
BIN1: length 26.4
  Top Layer w0.254: TB2.12 v4(85.34,51.43) ; U6.3 89.79,47.23 v4(85.34,47.23)
  Bottom Layer w0.254: v4(85.34,51.43) v4(85.34,47.23)
BIN2: length 26.7
  Top Layer w0.254: U6.2 90.09,44.31 v4(84.33,44.31) ; TB2.11 v4(84.33,48.89)
  Bottom Layer w0.254: v4(84.33,48.89) v4(84.33,44.31)
BO1: length 40.2
  Top Layer w0.254: v4(69.98,47.62) 54.28,47.62 TB2.7
  Bottom Layer w0.254: v4(69.98,47.62) 69.98,69.92 U7.1
BO2: length 50.2
  Top Layer w0.254: v4(82.42,50.03) 54.16,50.03 TB2.6
  Bottom Layer w0.254: U7.6 82.42,69.98 v4(82.42,50.03)
CIN1: length 29.7
  Top Layer w0.254: v4(40.13,70.6) 40.13,58.1 TB1.14 ; v4(26.67,70.6) 25.78,70.6 U8.3
  Bottom Layer w0.254: v4(40.13,70.6) v4(26.67,70.6)
CIN2: length 20.8
  Top Layer w0.254: v4(36.96,67.68) 36.96,60.63 TB1.15 ; v4(28.07,67.68) 28.07,70.02 U8.2
  Bottom Layer w0.254: v4(36.96,67.68) v4(28.07,67.68)
CO1: length 29.6
  Top Layer w0.254: v4(14.1,69.71) 9.77,69.71 U9.1 ; 23.5,53.97 v4(14.1,53.97)
  Bottom Layer w0.254: v4(14.1,53.97) v4(14.1,69.71)
CO2: length 19.7
  Top Layer w0.254: U9.6 9.7,57.14 v4(14.73,57.14) ; v3(14.61,51.43) 23.5,51.43
  Bottom Layer w0.254: v3(14.61,51.43) 14.73,51.55 v4(14.73,57.14)
DIN1: length 33.3
  Top Layer w0.254: TB1.12 36.2,53.77 v4(36.2,66.54) ; U8.4 22.73,70.06 v4(22.73,66.54)
  Bottom Layer w0.254: v4(36.2,66.54) v4(22.73,66.54)
DIN2: length 37.7
  Top Layer w0.254: v4(20.45,65.65) 20.45,70.14 U8.5 ; TB1.11 35.56,51.86 v4(35.56,65.65)
  Bottom Layer w0.254: v4(35.56,65.65) v4(20.45,65.65)
DIRA: length 28.5
  Top Layer w0.254: v4(94.23,46.98) 94.23,26.79 93.69,26.24 U13.3
  Bottom Layer w0.254: v4(94.23,46.98) 94.21,47 U11.4
DIRB: length 13.7
  Top Layer w0.254: U13.4 90.08,28.95 v4(87.76,28.95) ; v4(84.84,26.41) v4(84.84,28.95)
  Bottom Layer w0.254: v4(84.84,28.95) v4(87.76,28.95) ; v4(84.84,26.41) 90.3,26.41 U12.4
DO1: length 16.9
  Top Layer w0.254: 23.5,46.35 v4(12.83,46.35) ; U10.1 9.8,49.39 v4(12.83,49.39)
  Bottom Layer w0.254: v4(12.83,46.35) v4(12.83,49.39)
DO2: length 26
  Top Layer w0.254: 23.5,48.89 v4(13.46,48.89) ; v4(13.59,36.95) 9.86,36.95 U10.6
  Bottom Layer w0.254: v4(13.46,48.89) 13.46,37.07 v4(13.59,36.95)
ENA: length 23.8
  Top Layer w0.254: U13.2 91.83,23.74 v4(93.47,25.39) ; v4(93.47,42.03) v4(93.47,27.42)
  Bottom Layer w0.254: v4(93.47,27.42) v4(93.47,25.39) ; U11.6 93.45,42 v4(93.47,42.03)
ENB: length 16.3
  Top Layer w0.254: U13.5 90.16,31.36 87.5,31.36 87.12,30.98 v4(87.12,21.33)
  Bottom Layer w0.254: v4(87.12,21.33) 87.15,21.3 U12.6
ENCOA1: length 23.5
  Top Layer w0.254: U4.4 74.55,70.06 v4(74.55,67.55) ; CN3.1 74.61,62.41 v4(74.55,62.35)
  Bottom Layer w0.254: v4(74.55,62.35) v4(74.55,67.55)
ENCOA2: length 18.3
  Top Layer w0.254: U4.3 76.45,69.46 76.45,66.67 77.34,65.78 89.28,65.78 CN3.2
ENCOB1: length 16.3
  Top Layer w0.254: CN3.3 89.67,66.92 v4(77.47,66.92)
  Bottom Layer w0.254: U7.4 77.47,69.93 v4(77.47,66.92)
ENCOB2: length 19.6
  Top Layer w0.254: v4(74.93,73.14) 86.92,73.14 CN3.4
  Bottom Layer w0.254: v4(74.93,73.14) 74.93,70.44 U7.3
ENCOC1: length 15.9
  Top Layer w0.254: U9.4 9.82,61.97 v4(16.89,61.97)
  Bottom Layer w0.254: v4(16.89,61.97) 16.89,69.26 CN6.1
ENCOC2: length 16.3
  Top Layer w0.254: v4(13.46,64.38) 9.9,64.38 U9.3 ; v4(17.53,67.55) v4(13.46,67.55)
  Bottom Layer w0.254: v4(17.53,67.55) 19.81,67.55 20.34,68.08 CN6.2 ; v4(13.46,67.55) v4(13.46,64.38)
ENCOD1: length 41.2
  Top Layer w0.254: v4(17.53,66.67) 17.4,66.54 v4(15.49,66.54) ; U10.4 9.78,41.65 v4(15.49,41.65)
  Bottom Layer w0.254: v4(15.49,66.54) v4(15.49,41.65) ; CN6.3 22.84,67.53 21.97,66.67 v4(17.53,66.67)
ENCOD2: length 41.5
  Top Layer w0.254: v4(25.4,63.74) 25.4,67.05 v4(25.27,67.17) ; U10.3 10.36,44.95 v4(25.53,44.95)
  Bottom Layer w0.254: CN6.4 25.34,67.24 v4(25.27,67.17) ; v4(25.4,63.74) 25.4,45.08 v4(25.53,44.95)
POWER12V: length 16.9
  Bottom Layer w1.27: S1.2 27.31,7.61 21.09,7.61 SS1.1
PWMA: length 29.4
  Top Layer w0.254: v4(83.95,54.6) 89.93,54.6 U6.6 ; TB2.16 v4(84.07,61.59)
  Bottom Layer w0.254: v4(83.95,54.6) 83.95,61.46 v4(84.07,61.59)
PWMB: length 26.7
  Top Layer w0.254: U6.1 90.05,41.77 v4(85.09,41.77) ; TB2.10 v4(85.09,46.35)
  Bottom Layer w0.254: v4(85.09,46.35) v4(85.09,41.77)
PWMC: length 17.3
  Top Layer w0.254: U8.1 30.38,70.19 v4(30.61,69.97) ; TB1.16 38.99,62.04 v4(38.99,69.97)
  Bottom Layer w0.254: v4(38.99,69.97) v4(30.61,69.97)
PWMD: length 42
  Top Layer w0.254: v4(18.16,65.01) 18.16,69.92 U8.6 ; TB1.10 34.54,50.34 v4(34.54,65.01)
  Bottom Layer w0.254: v4(34.54,65.01) v4(18.16,65.01)
STEER1: length 4.1
  Top Layer w0.305: CN7.2 90.04,9.76 v3(90.04,6.83)
STEER2: length 9
  Top Layer w0.305: H6.4 87.5,12.06 88.39,12.94 90.73,12.94 CN7.1
STEER3: length 11.1
  Bottom Layer w0.305: v3(84.96,6.83) 85.22,7.08 85.22,11.55 86.49,12.82 90.6,12.82 CN8.2
STEER4: length 10
  Top Layer w0.305: v3(86.49,10.53) 86.13,10.53 v3(82.42,6.83)
  Bottom Layer w0.305: v3(86.49,10.53) 90.81,10.53 CN8.1
STEPA: length 32.3
  Top Layer w0.254: v4(94.87,44.5) 94.87,21.71 94.4,21.24 U13.1
  Bottom Layer w0.254: U11.5 v4(94.87,44.5)
STEPB: length 18.6
  Top Layer w0.254: v4(85.98,23.74) 85.98,33.26 86.61,33.9 90.12,33.9 U13.6
  Bottom Layer w0.254: v4(85.98,23.74) 90.35,23.74 U12.5
$1N3758: length 1.2
  Bottom Layer w1.27: 23.38,27.87 FU1.2
  vias: v2(23.38,27.87) v2(23.38,27.87)
$1N3767: length 6.2
  Top Layer w1.27: 23.38,26.17 17.14,26.17
  vias: v2(17.55,25.39)
$1N3769: length 2.4
  Bottom Layer w1.27: 65.56,33.54 66.99,34.97 FU2.2
$1N3771: length 7.8
  Bottom Layer w1.27: 5K.1 100nf#19.1 1K#3.2 65.64,28.35 65.56,28.44
$1N3772: length 3.5
  Bottom Layer w1.27: ss34.1 69.51,31.74 v2(66.4,31.74)
$1N3795: length 8.9
  Top Layer w1.27: v2(7.87,34.41) 5.87,32.4 10K.1 5.87,29.9 10K#2.2
  Bottom Layer w1.27: v2(7.87,34.41) 7.87,35.85 CN5.2
$1N3802: length 2
  Top Layer w1.27: LED4.2 73.54,5.56 1K.2
$1N3803: length 1.9
  Top Layer w1.27: LED3.2 75.68,5.4 1K#2.2
$1N3804: length 1.9
  Top Layer w1.27: 77.84,3.56 77.85,3.57 2K.2
$1N3805: length 1.7
  Top Layer w1.27: 79.98,3.56 2K#2.2
$1N4033: length 4.4
  Bottom Layer w1.27: CN1.2 12.5,16.3 SS1.2

## Copper pours and planes (outline as drawn; the poured copper is in the pictures)
GND on Top Layer: 54.99,78.98 58.67,78.98 58.67,75.3 54.99,75.3
GND on Top Layer: -14.48,106.16 123.57,106.16 123.57,-15.25 -14.48,-15.25
GND on Bottom Layer: -36.96,94.86 135.51,94.86 135.51,-11.19 -36.96,-11.19
VCC5V on Top Layer: 49.28,79.24 52.96,79.24 52.96,75.17 49.28,75.17
VCC7.4V on Top Layer: 43.69,78.98 47.5,78.98 47.5,75.68 43.69,75.68
VCC12V on Top Layer: 37.59,79.37 42.01,79.37 42.01,74.71 37.59,74.71

Small or netless copper shapes (teardrops, artwork), in the pictures only: 200 on Top Layer, 143 on Bottom Layer

## Text on the board
Top Silkscreen Layer: 12V | 7.4V | 5V | GND | ST3 | ST4 | 4 | STEER2 | STEER1 | 3 | 2 | 1 | 7.4 | CO1 | C2 | C1 | C02 | DO1 | D2 | D1 | DO2 | STEPA | STEPB | DIRA | ENA | DIRB | 3V | ENB | PWMA | PWMB | AIN2 | BIN2 | AIN1 | BIN1 | A2 | B2 | B1 | A1 | PWMD | DIN2 | DIN1 | CIN1 | CIN2 | PWMC | AO2 | BO1 | AO1 | BO2 | 关 | 开
